# Altium schematic sheet MainBoardPower.SchDoc
size A4
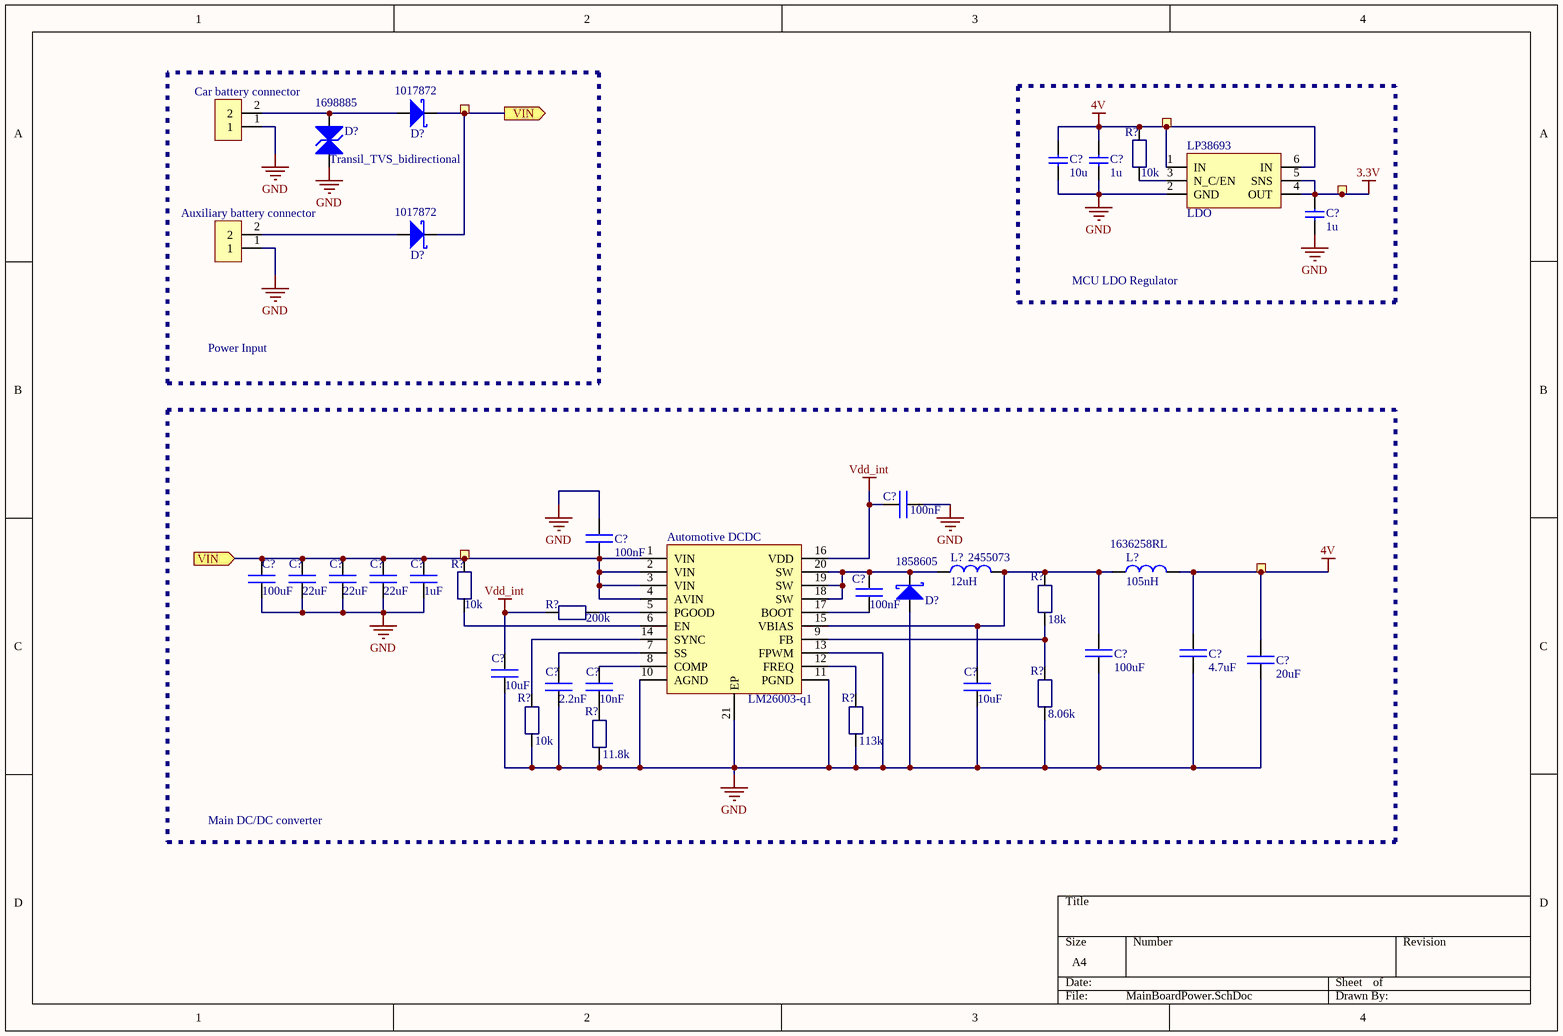
[diagram p0: MainBoardPower.SchDoc]

## Parts
(Parts that share a designator on the sheet are numbered #1, #2 ... from top to bottom, then left to right.)
?#1  Ø1.0mm,SMD  [TP_SMD_Ř1.0mm]  (value not drawn)  (no BOM)
?#2  Ø1.0mm,SMD  [TP_SMD_Ř1.0mm]  (value not drawn)  (no BOM)
?#3  Ø1.0mm,SMD  [TP_SMD_Ř1.0mm]  (value not drawn)  (no BOM)
?#4  Ø1.0mm,SMD  [TP_SMD_Ř1.0mm]  (value not drawn)  (no BOM)
?#5  Ø1.0mm,SMD  [TP_SMD_Ř1.0mm]  (value not drawn)  (no BOM)
Auxiliary_battery_connector  (no value)  [ARK_3.5mm]
C?#1  10u  [CAPC1608X06L]
C?#2  1u  [CAPC1608X06L]
C?#3  1u  [CAPC1608X06L]
C?#4  100nF  [0402]
C?#5  100nF  [0402]
C?#6  100uF  [1206]
C?#7  22uF  [0805]
C?#8  22uF  [0805]
C?#9  22uF  [0805]
C?#10  1uF  [0402]
C?#11  100nF  [0805]
C?#12  100uF  [1206]
C?#13  4.7uF  [0603]
C?#14  20uF  [0805]
C?#15  10uF  [0805]
C?#16  2.2nF  [0805]
C?#17  10nF  [0805]
C?#18  10uF  [0805]
Car_battery_connector  (no value)  [ARK_3.5mm]
D?#1  Supplier Part Number 1: 1017872  [DO-214-AA]  (hidden comment: Shottky_DO-214-AA)
D?#2  Transil_TVS_bidirectional  Supplier Part Number 1: 1698885  [DO-214-AB]
D?#3  Supplier Part Number 1: 1017872  [DO-214-AA]  (hidden comment: Shottky_DO-214-AA)
D?#4  Supplier Part Number 1: 1858605  [SMA]  (hidden comment: Shottky)
L?#1  12uH  Supplier Part Number 1: 2455073  [SRR1210A]
L?#2  105nH  Supplier Part Number 1: 1636258RL  [7.15mm x 7mm x 5mm]
LM26003-q1  Automotive DCDC  [TSSOP20_footprint]
LP38693  LDO  [WSON-6]
R?#1  value 10k  [RES_0402]  (hidden comment: RES_0402_1k)
R?#2  value 10k  [RES_0402]  (hidden comment: RES_0402_1k)
R?#3  value 18k  [RES_0402]  (hidden comment: RES_0402_1k)
R?#4  value 200k  [RES_0402]  (hidden comment: RES_0402_1k)
R?#5  value 8.06k  [RES_0402]  (hidden comment: RES_0402_1k)
R?#6  value 10k  [RES_0402]  (hidden comment: RES_0402_1k)
R?#7  value 113k  [RES_0402]  (hidden comment: RES_0402_1k)
R?#8  value 11.8k  [RES_0402]  (hidden comment: RES_0402_1k)

## Blocks framed on the sheet
Power Input: ?#1 Auxiliary_battery_connector Car_battery_connector D?#1-D?#3
MCU LDO Regulator: ?#2 ?#3 C?#1-C?#3 LP38693 R?#1
Main DC/DC converter: ?#4 ?#5 C?#4-C?#18 D?#4 L?#1 L?#2 LM26003-q1 R?#2-R?#8

## Ports
VIN (in), VIN (out)

## Nets
3.3V: ?#3.1 C?#3.1 LP38693.4(OUT) LP38693.5(SNS)
4V: ?#2.1 ?#5.1 C?#1.1 C?#2.1 C?#13.1 C?#14.2 L?#2.2 LP38693.1(IN) LP38693.6(IN) R?#1.2
GND: Auxiliary_battery_connector.1 C?#1.2 C?#2.2 C?#3.2 C?#4.2 C?#5.2 C?#6.1 C?#7.1 C?#8.1 C?#9.1 C?#10.1 C?#12.1 C?#13.2 C?#14.1 C?#15.1 C?#16.1 C?#18.1 Car_battery_connector.1 D?#2.1 D?#4.1 LM26003-q1.10(AGND) LM26003-q1.11(PGND) LM26003-q1.13(FPWM) LM26003-q1.21(EP) LP38693.2(GND) R?#5.2 R?#6.2 R?#7.2 R?#8.2
Vdd_int: C?#4.1 C?#15.2 LM26003-q1.16(VDD) R?#4.2
VIN: ?#1.1 ?#4.1 C?#5.1 C?#6.2 C?#7.2 C?#8.2 C?#9.2 C?#10.2 D?#1.2 D?#3.2 LM26003-q1.1(VIN) LM26003-q1.2(VIN) LM26003-q1.3(VIN) LM26003-q1.4(AVIN) R?#2.1 ; port VIN
NetAuxiliary_battery_connector_2: Auxiliary_battery_connector.2 D?#3.1
NetC?#11_1: C?#11.1 LM26003-q1.17(BOOT)
NetC?#11_2: C?#11.2 D?#4.2 L?#1.1 LM26003-q1.18(SW) LM26003-q1.19(SW) LM26003-q1.20(SW)
NetC?#12_2: C?#12.2 C?#18.2 L?#1.2 L?#2.1 LM26003-q1.15(VBIAS) R?#3.1
NetC?#16_2: C?#16.2 LM26003-q1.7(SS)
NetC?#17_1: C?#17.1 R?#8.1
NetC?#17_2: C?#17.2 LM26003-q1.8(COMP)
NetCar_battery_connector_2: Car_battery_connector.2 D?#1.1 D?#2.2
NetLM26003-q1_5: LM26003-q1.5(PGOOD) R?#4.1
NetLM26003-q1_6: LM26003-q1.6(EN) R?#2.2
NetLM26003-q1_9: LM26003-q1.9(FB) R?#3.2 R?#5.1
NetLM26003-q1_12: LM26003-q1.12(FREQ) R?#7.1
NetLM26003-q1_14: LM26003-q1.14(SYNC) R?#6.1
NetLP38693_3: LP38693.3(N_C/EN) R?#1.1

## Library data of the parts
?#1-?#5 = TESTPAD: 1.0mm circular SMD testpad; Part Number: TP_SMD_Ø1.0MM; Manufacturer: Nordic Semiconductor; Artikkelnr Noca: N.A.; Manufacturer Part Number: *; Datasheet: *; Footprint: TP_SMD_Ø1.0mm; LatestRevisionDate: 2013-06-11; Pin Count: 1; Publisher: Nordic Semiconductor; Published: 2013-06-11; Value: Ø1.0mm,SMD; Note: *; Supplier: *; Supplier part number: *; 2nd source Supplier: *; 2nd source part number: *
Auxiliary_battery_connector Car_battery_connector = Component_1
C?#1-C?#3 = C0603-4µ7: Capacitor, X5R, ±10%; Value: 4.7µF; Note: 6.3V; Artikkelnr Noca: 20069060; Artikkelnr Simpro: N.A.; Part Number: C0603-4µ7; Manufacturer: *; Manufacturer Part Number: *; Datasheet: *; LatestRevisionDate: 2009-11-23; Pin Count: 2; Publisher: Nordic Semiconductor; Published: 2009-05-08; Supplier: *; Supplier part number: *; 2nd source Supplier: *; 2nd source part number: *; Footprint Doc: 0603; Supplier 1: Farnell; Supplier Part Number 1: 1327684
C?#4-C?#18 = Capacitor_MLCC: ?
D?#2 = TVS_bidirectional: TVS_bi; Supplier 1: Farnell
D?#4 = Shottky_diode: Supplier 1: Farnell
L?#1 L?#2 = Inductor: Supplier 1: Farnell
LM26003-q1 = LM26003-q1
LP38693 = LP38693 WSON Package
D?#1 D?#3 = Shottky_DO-214-AA: Supplier 1: Farnell
R?#1-R?#8 = RES_0402_1k: Supplier 1: Digi-Key; Supplier 2: Farnell; Supplier 3: Mouser; Supplier Part Number 1: 311-1.0KJRTR-ND; Supplier Part Number 2: 1358043; Supplier Part Number 3: 603-RC0402FR-071KL